# EAGLE schematic ESQUEMATICO_STEPTRACK_V1 (EAGLE 9.6.2)
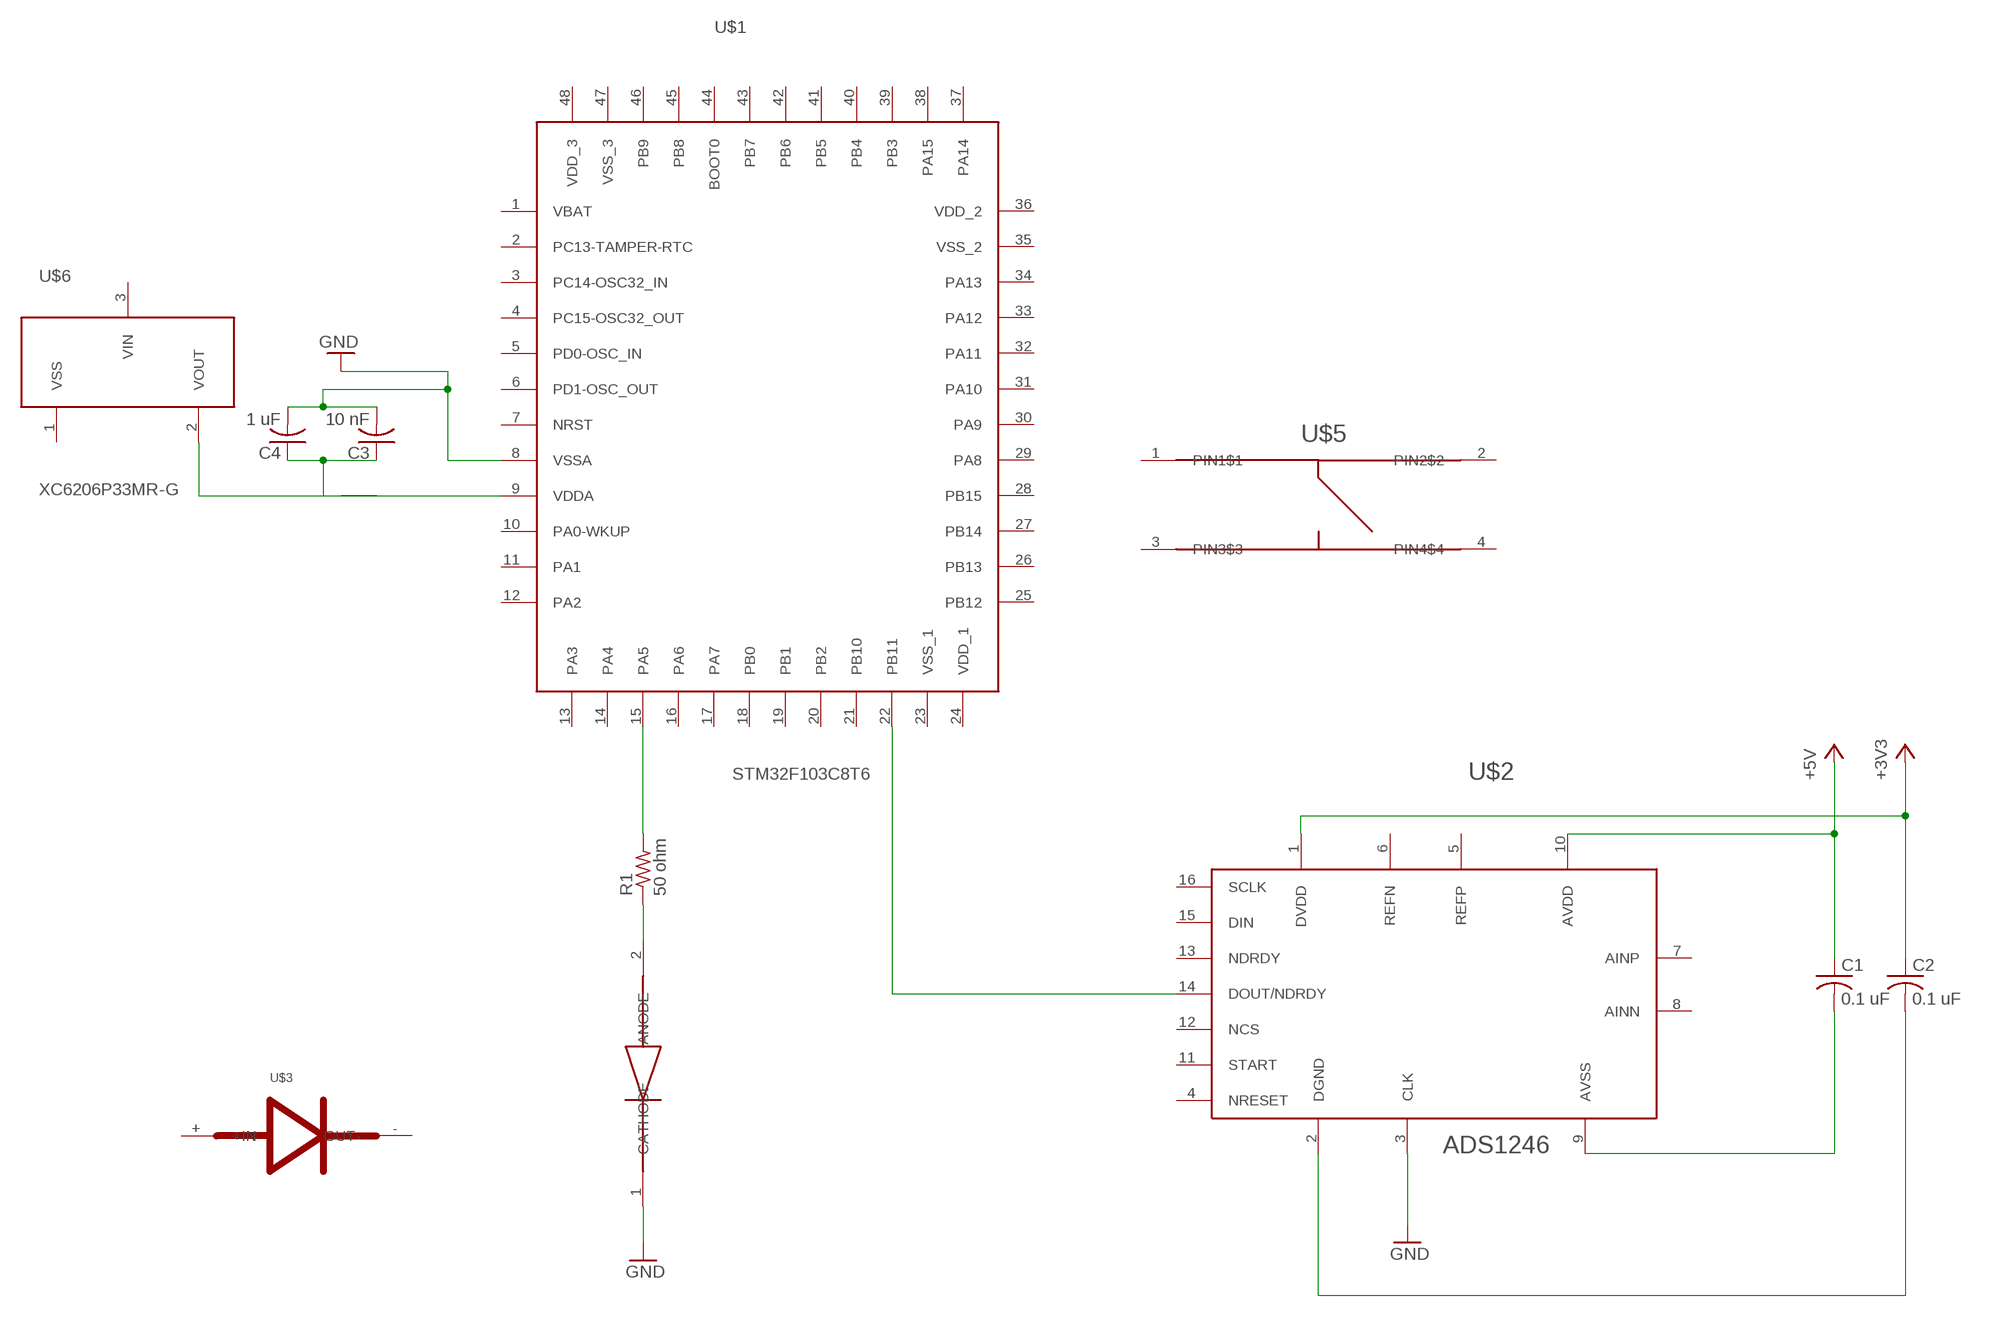
[diagram p0: schematic, sheet 1]

## Parts
C1  0.1 uF  C-USC0805  [C0805]
C2  0.1 uF  C-USC0805  [C0805]
C3  10 nF  C-USC0805  [C0805]
C4  1 uF  C-USC0805  [C0805]
R1  50 ohm  R-US_R0805  [R0805]
U$1  STM32F103C8T6  [48-LQFP]
U$2  ADS1246  [16-TSSOP]
U$3  C5SMF-RJE-CT0W0BB2  [C5SMF-RJE-CT0W0BB2]
U$4  APA2107QWF/D  [APA2107QWF/D]
U$5  PTS526  [PTS526]
U$6  XC6206P33MR-G  [SOT-23]

## Nets
+3V3: C2.1 U$2.1(DVDD)
+5V: C1.1 U$2.10(AVDD)
GND: C3.2 C4.2 U$1.8(VSSA) U$2.3(CLK) U$4.1(CATHODE)
N$1: U$1.22(PB11) U$2.14(DOUT/NDRDY)
N$2: R1.2 U$1.15(PA5)
N$3: C1.2 U$2.9(AVSS)
N$4: R1.1 U$4.2(ANODE)
N$5: C2.2 U$2.2(DGND)
N$6: U$1.9(VDDA) U$6.2(VOUT)
N$8: C3.1 C4.1
Unconnected: U$1.2(PC13-TAMPER-RTC) U$1.3(PC14-OSC32_IN) U$1.4(PC15-OSC32_OUT) U$1.5(PD0-OSC_IN) U$1.6(PD1-OSC_OUT) U$1.7(NRST) U$1.10(PA0-WKUP) U$1.11(PA1) U$1.12(PA2) U$1.13(PA3) U$1.14(PA4) U$1.16(PA6) U$1.17(PA7) U$1.18(PB0) U$1.19(PB1) U$1.20(PB2) U$1.21(PB10) U$1.25(PB12) U$1.26(PB13) U$1.27(PB14) U$1.28(PB15) U$1.29(PA8) U$1.30(PA9) U$1.31(PA10) U$1.32(PA11) U$1.33(PA12) U$1.34(PA13) U$1.37(PA14) U$1.38(PA15) U$1.39(PB3) U$1.40(PB4) U$1.41(PB5) U$1.42(PB6) U$1.43(PB7) U$1.44(BOOT0) U$1.45(PB8) U$1.46(PB9) U$2.4(NRESET) U$2.5(REFP) U$2.6(REFN) U$2.7(AINP) U$2.8(AINN) U$2.11(START) U$2.12(NCS) U$2.13(NDRDY) U$2.15(DIN) U$2.16(SCLK) U$3.+(+IN) U$3.-(OUT-) U$5.1(PIN1$1) U$5.2(PIN2$2) U$5.3(PIN3$3) U$5.4(PIN4$4)

## Power pins joined to a net without a drawn wire
VBAT: U$1.1(VBAT)
VDD_1: U$1.24(VDD_1)
VDD_2: U$1.36(VDD_2)
VDD_3: U$1.48(VDD_3)
VIN: U$6.3(VIN)
VSS: U$6.1(VSS)
VSS_1: U$1.23(VSS_1)
VSS_2: U$1.35(VSS_2)
VSS_3: U$1.47(VSS_3)

## Library data of the parts
C1-C4 = rcl:C-US: CAPACITOR, American symbol; SPICEPREFIX: C
R1 = rcl:R-US_: RESISTOR, American symbol; SPICEPREFIX: R
U$1 = STM32F103C8T6 - STM:STM32F103C8T6
U$2 = ADS1246:ADS1246
U$3 = LED_ROJO:C5SMF-RJE-CT0W0BB2
U$4 = LED_OTRO:APA2107QWF/D
U$5 = PTS526:PTS526
U$6 = XC6206P332MR-G-TS:XC6206P33MR-G